# Altium schematic sheet hv_breakout.SchDoc
size A4; Organization: Badgerloop; Address1: 133 Engineering Research; Address2: Building; Address3: Madison, WI 53715
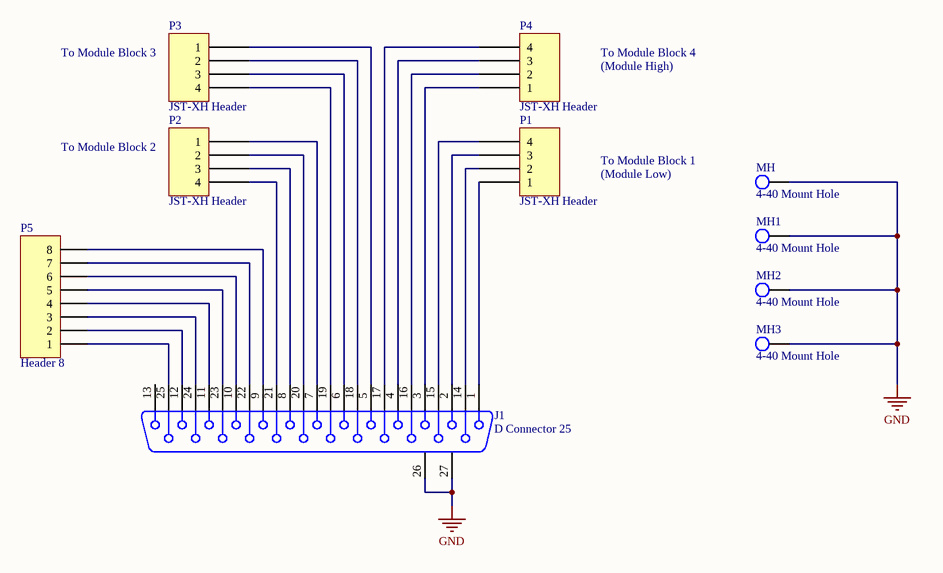
[diagram p0: hv_breakout.SchDoc]

## Parts
J1  D Connector 25  [DSUB1.385-2H25A]
MH  4-40 Mount Hole  [MH]
MH1  4-40 Mount Hole  [MH]
MH2  4-40 Mount Hole  [MH]
MH3  4-40 Mount Hole  [MH]
P1  JST-XH Header  [JST - XH 4 Pos]
P2  JST-XH Header  [JST - XH 4 Pos]
P3  JST-XH Header  [JST - XH 4 Pos]
P4  JST-XH Header  [JST - XH 4 Pos]
P5  Header 8  [Pin Header 1x8 TH Pitch 2.54mm]

## Nets
GND: J1.26(MH1) J1.27(MH2) MH.46 MH1.46 MH2.46 MH3.46
NetJ1_1: J1.1 P1.1
NetJ1_2: J1.2 P1.3
NetJ1_3: J1.3 P4.1
NetJ1_4: J1.4 P4.3
NetJ1_5: J1.5 P3.1
NetJ1_6: J1.6 P3.3
NetJ1_7: J1.7 P2.1
NetJ1_8: J1.8 P2.3
NetJ1_9: J1.9 P5.8
NetJ1_10: J1.10 P5.6
NetJ1_11: J1.11 P5.4
NetJ1_12: J1.12 P5.2
NetJ1_14: J1.14 P1.2
NetJ1_15: J1.15 P1.4
NetJ1_16: J1.16 P4.2
NetJ1_17: J1.17 P4.4
NetJ1_18: J1.18 P3.2
NetJ1_19: J1.19 P3.4
NetJ1_20: J1.20 P2.2
NetJ1_21: J1.21 P2.4
NetJ1_22: J1.22 P5.7
NetJ1_23: J1.23 P5.5
NetJ1_24: J1.24 P5.3
NetJ1_25: J1.25 P5.1

Not connected (* = marked no-connect by the designer): J1 13

## Notes on the sheet
- (near P3) To Module Block 3
- To Module Block 4
- (Module High)
- To Module Block 2
- To Module Block 1
- (Module Low)
- Title
- Size:
- Date:
- A4
- Number:
- Time:
- Revision:
- Sheet
- of
- File:

## Library data of the parts
J1 = D Connector 25: Receptacle Assembly, 25 Position, Right Angle; PackageDocument: U; Positions: 25; Published: 15-Jun-2001; LatestRevisionDate: 17-Jul-2002; LatestRevisionNote: Re-released for DXP Platform.; DatasheetDocument: 19-Mar-1999; PackageReference: 787202; Publisher: Altium Limited; Orientation: Right Angle; Gender: Receptacle
P1-P4 = JST-XH Header: JST-XH CONN HEADER VERT 4POS 2.5MM; Manufacturer: JST Sales America; Manufacturer P/N: B4B-XH-A(LF)(SN); Digikey Link: https://www.digikey.com/product-detail/en/jst-sales-america-inc/B4B-XH-A-LF-SN/455-2249-ND/1651047; Digikey P/N: 455-2249-ND
P5 = Header 8: Header, 8-Pin; LatestRevisionDate: 17-Jul-2002; LatestRevisionNote: Re-released for DXP Platform.; Publisher: Altium Limited